# Altium project Relay Controller REV3.PrjPcb
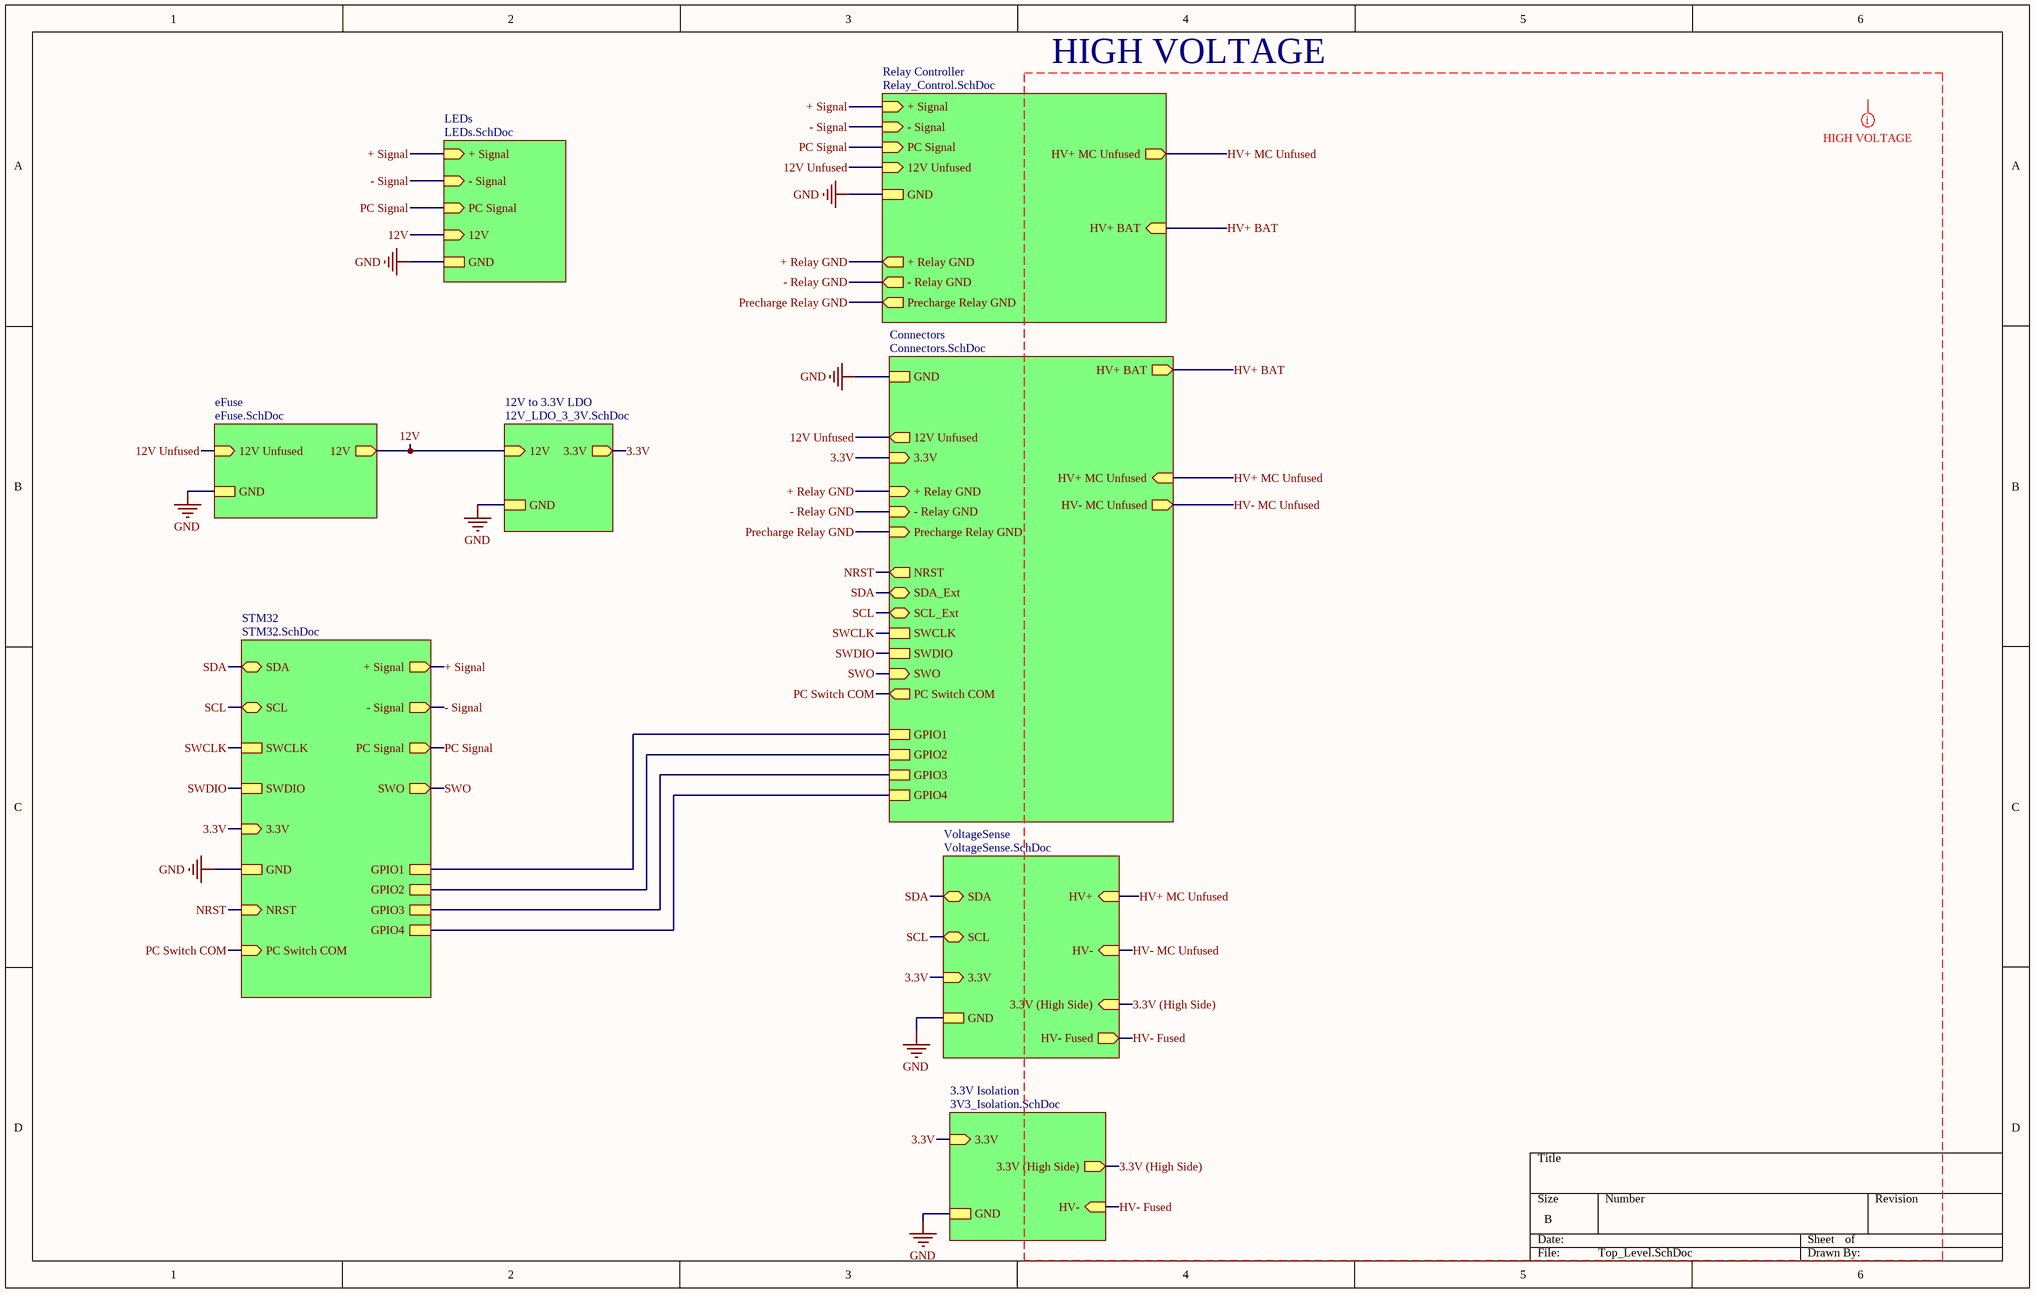
[diagram p0: Top_Level.SchDoc]
5 sheets, 30 parts. Net scope: hierarchical (ports join the sheet entries above them; power ports are global).
Board file: Relay_Controller_REV3.PcbDoc
Sheets:
  Top_Level.SchDoc
    Connectors = Connectors.SchDoc
    LEDs = LEDs.SchDoc
    VoltageSense = VoltageSense.SchDoc
    3.3V Isolation = 3V3_Isolation.SchDoc

## Sheet Top_Level.SchDoc
size B; SheetNumber: 5; SheetTotal: 5

### Sub-sheets
3.3V Isolation = 3V3_Isolation.SchDoc: GND, 3.3V (in), 3.3V (High Side) (out), HV- (in)
12V to 3.3V LDO = 12V_LDO_3_3V.SchDoc (file not in this document): 12V (in), GND, 3.3V (out)
Connectors = Connectors.SchDoc: GND, + Relay GND (in), - Relay GND (in), Precharge Relay GND (in), HV+ BAT (out), 12V Unfused (out), HV+ MC Unfused (in), HV- MC Unfused (out), 3.3V (in), SDA_Ext (bidir), SCL_Ext (bidir), SWCLK, SWDIO, SWO (in), NRST (out), GPIO1, GPIO2, GPIO3, GPIO4, PC Switch COM (out)
eFuse = eFuse.SchDoc (file not in this document): 12V Unfused (in), GND, 12V (out)
LEDs = LEDs.SchDoc: + Signal (in), - Signal (in), PC Signal (in), 12V (in), GND
Relay Controller = Relay_Control.SchDoc (file not in this document): + Signal (in), - Signal (in), PC Signal (in), 12V Unfused (in), GND, + Relay GND (out), - Relay GND (out), Precharge Relay GND (out), HV+ MC Unfused (out), HV+ BAT (in)
STM32 = STM32.SchDoc (file not in this document): SDA (bidir), SCL (bidir), 3.3V (in), + Signal (out), - Signal (out), PC Signal (out), GND, SWCLK, SWDIO, SWO (out), NRST (in), GPIO1, GPIO2, GPIO3, GPIO4, PC Switch COM (in)
VoltageSense = VoltageSense.SchDoc: HV+ (in), HV- (in), 3.3V (in), SDA (bidir), SCL (bidir), GND, 3.3V (High Side) (in), HV- Fused (out)

### Nets
GND: sheet Relay Controller/GND, sheet Connectors/GND, sheet LEDs/GND, sheet STM32/GND, sheet VoltageSense/GND, sheet eFuse/GND, sheet 12V to 3.3V LDO/GND, sheet 3.3V Isolation/GND
3.3V: sheet Connectors/3.3V, sheet STM32/3.3V, sheet VoltageSense/3.3V, sheet 12V to 3.3V LDO/3.3V, sheet 3.3V Isolation/3.3V
3.3V (High Side): sheet VoltageSense/3.3V (High Side), sheet 3.3V Isolation/3.3V (High Side)
12V: sheet LEDs/12V, sheet eFuse/12V, sheet 12V to 3.3V LDO/12V
12V Unfused: sheet Relay Controller/12V Unfused, sheet Connectors/12V Unfused, sheet eFuse/12V Unfused
+ Relay GND: sheet Relay Controller/+ Relay GND, sheet Connectors/+ Relay GND
+ Signal: sheet Relay Controller/+ Signal, sheet LEDs/+ Signal, sheet STM32/+ Signal
- Relay GND: sheet Relay Controller/- Relay GND, sheet Connectors/- Relay GND
- Signal: sheet Relay Controller/- Signal, sheet LEDs/- Signal, sheet STM32/- Signal
HV+ BAT: sheet Relay Controller/HV+ BAT, sheet Connectors/HV+ BAT
HV+ MC Unfused: sheet Relay Controller/HV+ MC Unfused, sheet Connectors/HV+ MC Unfused, sheet VoltageSense/HV+
HV- Fused: sheet VoltageSense/HV- Fused, sheet 3.3V Isolation/HV-  [project net HV-]
HV- MC Unfused: sheet Connectors/HV- MC Unfused, sheet VoltageSense/HV-
NRST: sheet Connectors/NRST, sheet STM32/NRST
PC Signal: sheet Relay Controller/PC Signal, sheet LEDs/PC Signal, sheet STM32/PC Signal
PC Switch COM: sheet Connectors/PC Switch COM, sheet STM32/PC Switch COM
Precharge Relay GND: sheet Relay Controller/Precharge Relay GND, sheet Connectors/Precharge Relay GND
SCL: sheet Connectors/SCL_Ext, sheet STM32/SCL, sheet VoltageSense/SCL
SDA: sheet Connectors/SDA_Ext, sheet STM32/SDA, sheet VoltageSense/SDA
SWCLK: sheet Connectors/SWCLK, sheet STM32/SWCLK
SWDIO: sheet Connectors/SWDIO, sheet STM32/SWDIO
SWO: sheet Connectors/SWO, sheet STM32/SWO
NetJ12_1: sheet Connectors/GPIO1, sheet STM32/GPIO1
NetJ12_2: sheet Connectors/GPIO2, sheet STM32/GPIO2
NetJ12_3: sheet Connectors/GPIO3, sheet STM32/GPIO3
NetJ12_4: sheet Connectors/GPIO4, sheet STM32/GPIO4

### Layout directives
mark named HIGH VOLTAGE: 3.3V (High Side), HV+ BAT, HV+ MC Unfused, HV- Fused, HV- MC Unfused

### Notes on the sheet
- HIGH VOLTAGE

## Sheet Connectors.SchDoc
size A; SheetNumber: 3; SheetTotal: 5
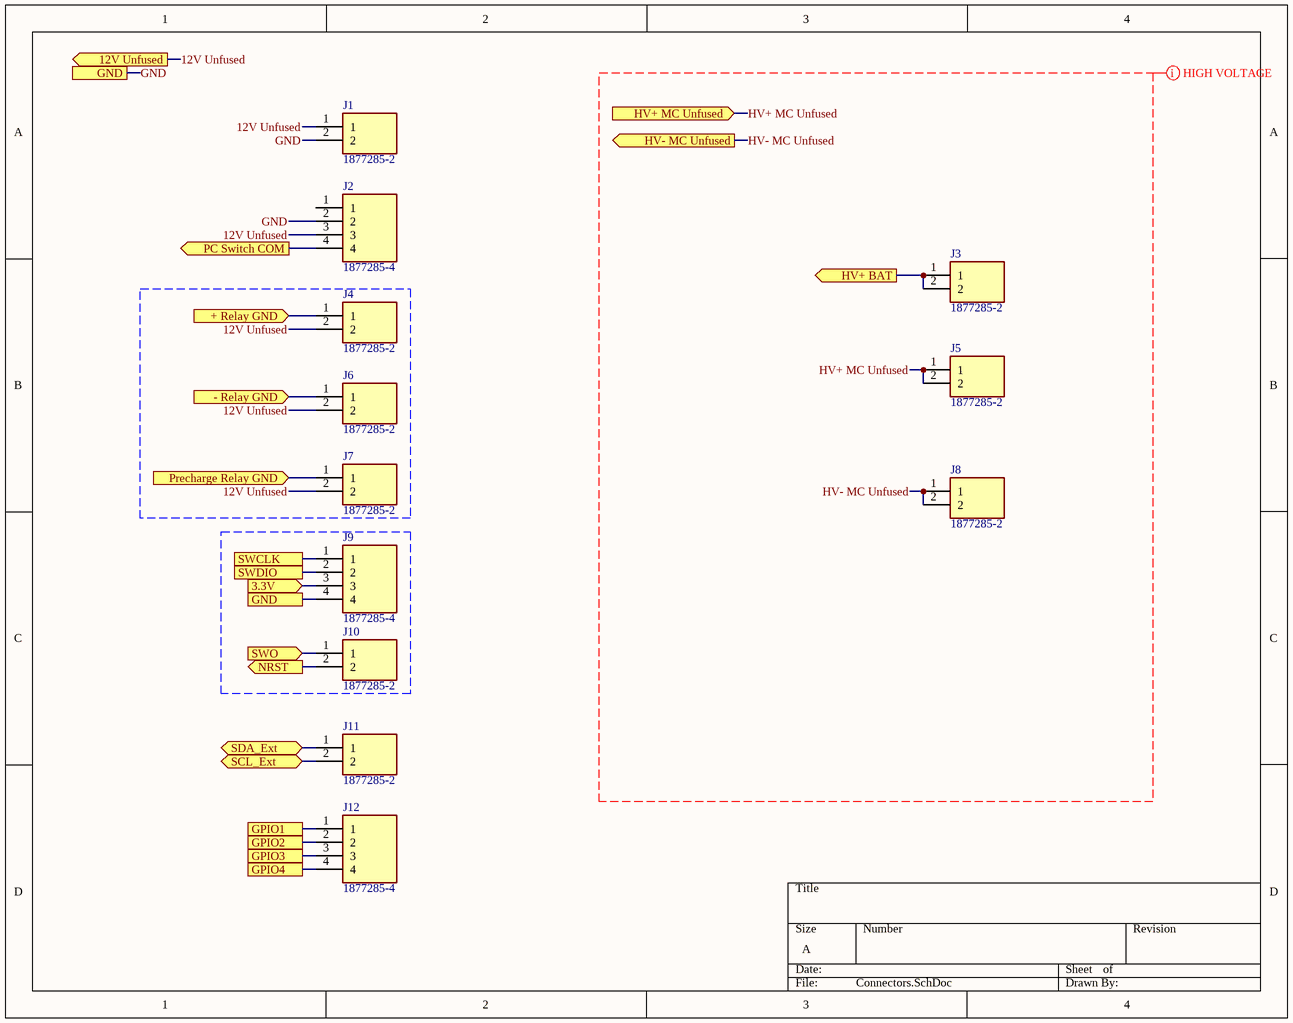
[diagram p1: Connectors.SchDoc]

### Parts
J1  1877285-2  [18772852]
J2  1877285-4  [18772854]
J3  1877285-2  [18772852]
J4  1877285-2  [18772852]
J5  1877285-2  [18772852]
J6  1877285-2  [18772852]
J7  1877285-2  [18772852]
J8  1877285-2  [18772852]
J9  1877285-4  [18772854]
J10  1877285-2  [18772852]
J11  1877285-2  [18772852]
J12  1877285-4  [18772854]

### Ports
3.3V (in), 12V Unfused (out), + Relay GND (in), - Relay GND (in), GND, GPIO1, GPIO2, GPIO3, GPIO4, HV+ BAT (out), HV+ MC Unfused (in), HV- MC Unfused (out), NRST (out), PC Switch COM (out), Precharge Relay GND (in), SCL_Ext (bidir), SDA_Ext (bidir), SWCLK, SWDIO, SWO (in)

### Nets
GND: J1.2 J2.2 J9.4 ; port GND
3.3V: J9.3 ; port 3.3V
12V Unfused: J1.1 J2.3 J4.2 J6.2 J7.2 ; port 12V Unfused
+ Relay GND: J4.1 ; port + Relay GND
- Relay GND: J6.1 ; port - Relay GND
HV+ BAT: J3.1 J3.2 ; port HV+ BAT
HV+ MC Unfused: J5.1 J5.2 ; port HV+ MC Unfused
HV- MC Unfused: J8.1 J8.2 ; port HV- MC Unfused
NRST: J10.2 ; port NRST
PC Switch COM: J2.4 ; port PC Switch COM
Precharge Relay GND: J7.1 ; port Precharge Relay GND
SCL: J11.2 ; port SCL_Ext
SDA: J11.1 ; port SDA_Ext
SWCLK: J9.1 ; port SWCLK
SWDIO: J9.2 ; port SWDIO
SWO: J10.1 ; port SWO
NetJ12_1: J12.1 ; port GPIO1
NetJ12_2: J12.2 ; port GPIO2
NetJ12_3: J12.3 ; port GPIO3
NetJ12_4: J12.4 ; port GPIO4

Not connected (* = marked no-connect by the designer): J2 1

### Layout directives
mark named HIGH VOLTAGE: HV+ MC Unfused, HV- MC Unfused

### Library data of the parts
J1 J3-J8 J10 J11 = 1877285-2: Connector; Manufacturer_Name: TE Connectivity; Datasheet Link: https://www.te.com/commerce/DocumentDelivery/DDEController?Action=srchrtrv&DocNm=7-1773458-5_ECONOMY_POWER_QRG&DocType=Data%20Sheet&DocLang=English&PartCntxt=1877285-2&DocFormat=pdf; Height: 12mm; Manufacturer_Part_Number: 1877285-2; Mouser Part Number: 571-1877285-2; Mouser Price/Stock: https://www.mouser.co.uk/ProductDetail/TE-Connectivity/1877285-2?qs=ka3zfMQDmFlAIZq5pDt5JA%3D%3D; Arrow Part Number: 1877285-2; Arrow Price/Stock: https://www.arrow.com/en/products/1877285-2/te-connectivity?region=europe
J2 J9 J12 = 1877285-4: Connector; Manufacturer_Name: TE Connectivity; Datasheet Link: https://www.te.com/commerce/DocumentDelivery/DDEController?Action=srchrtrv&DocNm=1877285&DocType=Customer%20Drawing&DocLang=English&PartCntxt=1877285-4&DocFormat=pdf; Height: 12.5mm; Manufacturer_Part_Number: 1877285-4; Mouser Part Number: 571-1877285-4; Mouser Price/Stock: https://www.mouser.co.uk/ProductDetail/TE-Connectivity/1877285-4?qs=ka3zfMQDmFkZPBtotDIXvQ%3D%3D; Arrow Part Number: 1877285-4; Arrow Price/Stock: https://www.arrow.com/en/products/1877285-4/te-connectivity?region=nac

## Sheet LEDs.SchDoc
size A; SheetNumber: 4; SheetTotal: 5
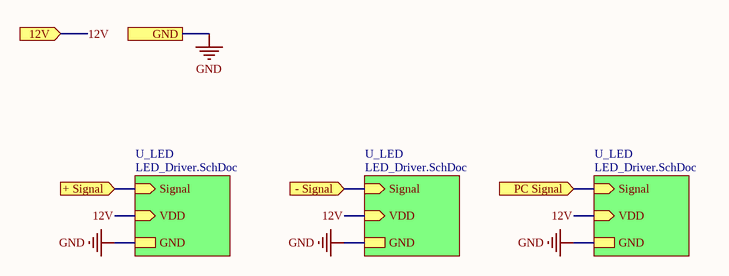
[diagram p2: LEDs.SchDoc]

### Sub-sheets
U_LED = LED_Driver.SchDoc (file not in this document): Signal (in), VDD (in), GND
U_LED = LED_Driver.SchDoc (file not in this document): Signal (in), VDD (in), GND
U_LED = LED_Driver.SchDoc (file not in this document): Signal (in), VDD (in), GND

### Ports
12V (in), + Signal (in), - Signal (in), GND, PC Signal (in)

### Nets
GND: port GND, sheet U_LED/GND, sheet U_LED/GND, sheet U_LED/GND
12V: port 12V, sheet U_LED/VDD, sheet U_LED/VDD, sheet U_LED/VDD
+ Signal: port + Signal, sheet U_LED/Signal
- Signal: port - Signal, sheet U_LED/Signal
PC Signal: port PC Signal, sheet U_LED/Signal

## Sheet VoltageSense.SchDoc
size A; SheetNumber: 5; SheetTotal: 5
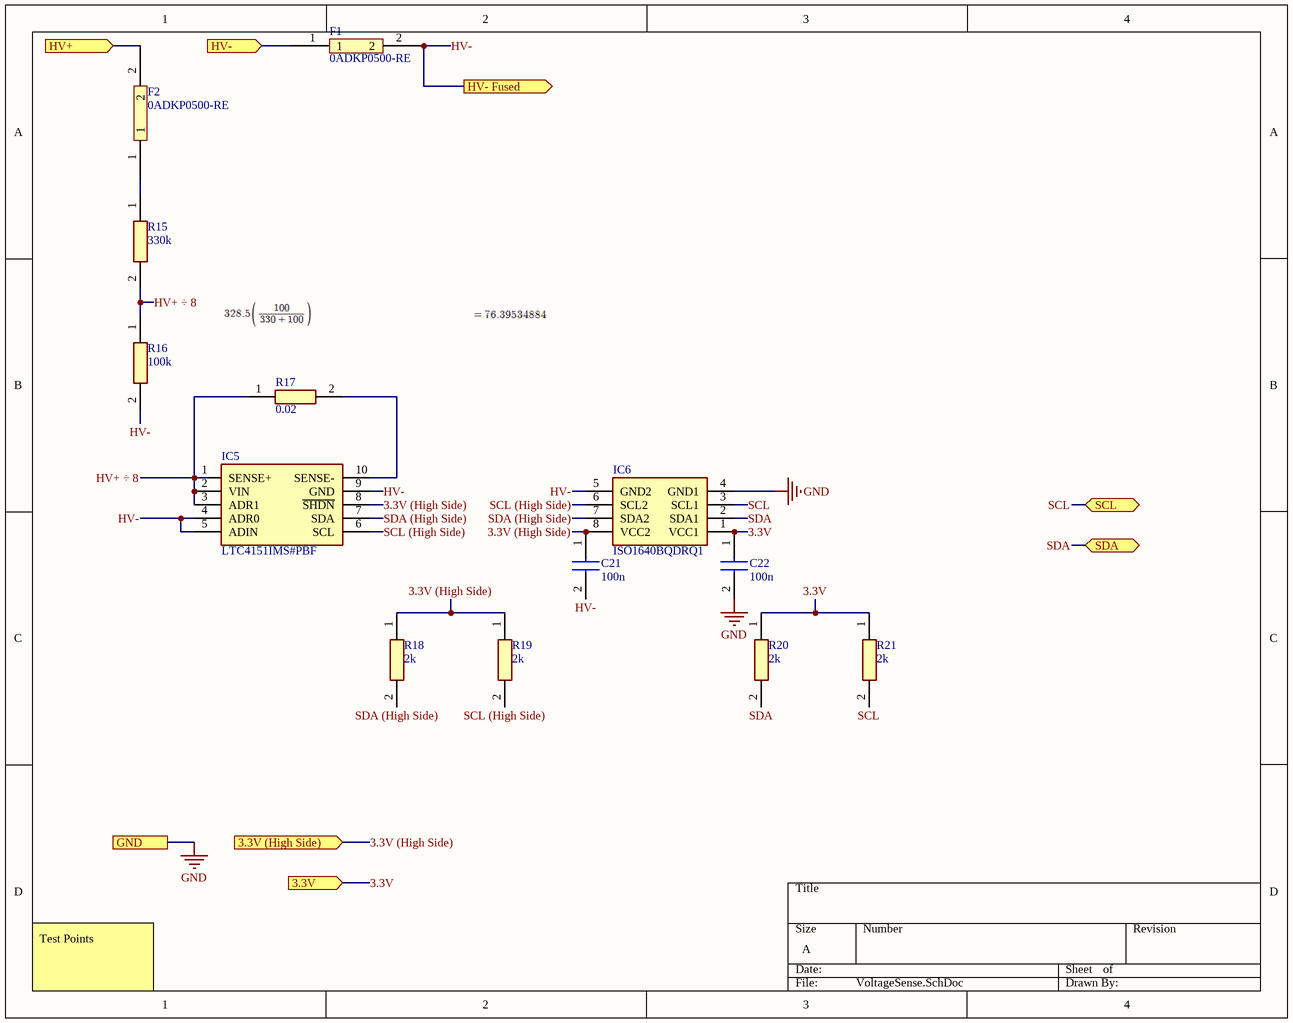
[diagram p3: VoltageSense.SchDoc]

### Parts
C21  100n  [CAPC3216X94N]
C22  100n  [CAPC3216X94N]
F1  0ADKP0500-RE  [0ADKP0500-RE]
F2  0ADKP0500-RE  [0ADKP0500-RE]
IC5  LTC4151IMS#PBF  [SOP50P490X110-10N]
IC6  ISO1640BQDRQ1  [SOIC127P600X175-8N]
R15  330k  [ERJP08_(1206)]
R16  100k  [RESC3216X65N]
R17  0.02  [RESC3216X68N]
R18  2k  [RESC3116X65N]
R19  2k  [RESC3116X65N]
R20  2k  [RESC3116X65N]
R21  2k  [RESC3116X65N]

### Ports
3.3V (High Side) (in), 3.3V (in), GND, HV+ (in), HV- (in), HV- Fused (out), SCL (bidir), SDA (bidir)

### Nets
GND: C22.2 IC6.4(GND1) ; port GND
3.3V: C22.1 IC6.1(VCC1) R20.1 R21.1 ; port 3.3V
3.3V (High Side): C21.1 IC5.8(~{SHDN}) IC6.8(VCC2) R18.1 R19.1 ; port 3.3V (High Side)
HV+ MC Unfused: F2.2 ; port HV+
HV+ ÷ 8: IC5.1(SENSE+) IC5.2(VIN) IC5.3(ADR1) R15.2 R16.1 R17.1
HV-: C21.2 F1.2 IC5.4(ADR0) IC5.5(ADIN) IC5.9(GND) IC6.5(GND2) R16.2 ; port HV- Fused
HV- MC Unfused: F1.1 ; port HV-
SCL: IC6.3(SCL1) R21.2 ; port SCL
SCL (High Side): IC5.6(SCL) IC6.6(SCL2) R19.2
SDA: IC6.2(SDA1) R20.2 ; port SDA
SDA (High Side): IC5.7(SDA) IC6.7(SDA2) R18.2
NetF2_1: F2.1 R15.1
NetIC5_10: IC5.10(SENSE-) R17.2

### Notes on the sheet
- Test Points

### Library data of the parts
C21 C22 = 12065C104J4Z2A: Capacitor; Manufacturer_Name: Kyocera AVX; Datasheet Link: https://spicat.kyocera-avx.com/product/mlcc/chartview/12065C104J4Z2A/DataSheet/X7R; Height: 0.94mm; Manufacturer_Part_Number: 12065C104J4Z2A; Mouser Part Number: 581-12065C104J4Z2A; Mouser Price/Stock: https://www.mouser.com/Search/Refine.aspx?Keyword=581-12065C104J4Z2A
F1 F2 = 0ADKP0500-RE: Fuse
IC5 = LTC4151IMS#PBF: Integrated Circuit; Manufacturer_Name: Analog Devices; Datasheet Link: http://www.linear.com/docs/26089; Height: 1.1mm; Manufacturer_Part_Number: LTC4151IMS#PBF; Mouser Part Number: 584-LTC4151IMS#PBF; Mouser Price/Stock: https://www.mouser.co.uk/ProductDetail/Analog-Devices/LTC4151IMSPBF?qs=hVkxg5c3xu%2F2n6Fpk%2FlWrA%3D%3D; Arrow Part Number: LTC4151IMS#PBF; Arrow Price/Stock: https://www.arrow.com/en/products/ltc4151imspbf/analog-devices?region=europe
IC6 = ISO1640BQDRQ1: Integrated Circuit; Manufacturer_Name: Texas Instruments; Datasheet Link: https://www.ti.com/lit/ds/symlink/iso1640.pdf; Height: 1.75mm; Manufacturer_Part_Number: ISO1640BQDRQ1; Mouser Part Number: 595-ISO1640BQDRQ1; Mouser Price/Stock: https://www.mouser.co.uk/ProductDetail/Texas-Instruments/ISO1640BQDRQ1?qs=QNEnbhJQKvat3Z1mRPODGw%3D%3D; Arrow Part Number: ISO1640BQDRQ1; Arrow Price/Stock: https://www.arrow.com/en/products/iso1640bqdrq1/texas-instruments?region=nac
R15 = ERJ-P08D3303V: Resistor; Manufacturer_Name: Panasonic; Datasheet Link: http://industrial.panasonic.com/cdbs/www-data/pdf/RDO0000/AOA0000C331.pdf; Height: 0.7mm; Manufacturer_Part_Number: ERJ-P08D3303V
R16 = MCA12060C1003FP500: Resistor; Manufacturer_Name: Vishay; Datasheet Link: https://componentsearchengine.com/Datasheets/1/MCA12060C1003FP500.pdf; Height: 0.65mm; Manufacturer_Part_Number: MCA12060C1003FP500; Mouser Part Number: 594-MCA12060C1003FP5; Mouser Price/Stock: https://www.mouser.com/Search/Refine.aspx?Keyword=594-MCA12060C1003FP5
R17 = PCS1206DR0200ET: Resistor; Manufacturer_Name: Ohmite; Datasheet Link: https://componentsearchengine.com/Datasheets/1/PCS1206DR0200ET.pdf; Height: 0.684mm; Manufacturer_Part_Number: PCS1206DR0200ET; Mouser Part Number: 588-PCS1206DR0200ET; Mouser Price/Stock: https://www.mouser.co.uk/ProductDetail/Ohmite/PCS1206DR0200ET?qs=Zz7%252BYVVL6bHe1REzh6xp%2Fw%3D%3D
R18-R21 = CHP1206AFX-2001ELF: Resistor; Manufacturer_Name: Bourns; Datasheet Link: https://www.mouser.mx/datasheet/2/54/chp-a-1858677.pdf; Height: 0.65mm; Manufacturer_Part_Number: CHP1206AFX-2001ELF; Mouser Part Number: 652-CHP1206AFX-2001L; Mouser Price/Stock: https://www.mouser.co.uk/ProductDetail/Bourns/CHP1206AFX-2001ELF?qs=GedFDFLaBXERFI3Dnxqg6Q%3D%3D

## Sheet 3V3_Isolation.SchDoc
size A
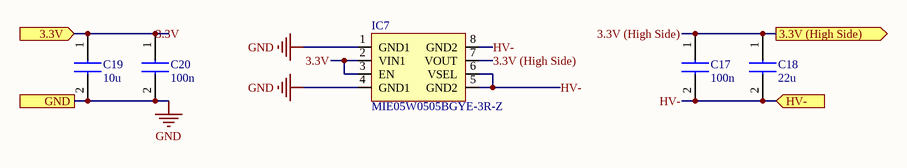
[diagram p4: 3V3_Isolation.SchDoc]

### Parts
C17  100n  [CAPC3216X94N]
C18  22u  [CAPC3216X180N]
C19  10u  [CAPC3216X180N]
C20  100n  [CAPC3216X94N]
IC7  MIE05W0505BGYE-3R-Z  [SOIC127P1030X265-8N]

### Ports
3.3V (High Side) (out), 3.3V (in), GND, HV- (in)

### Nets
GND: C19.2 C20.2 IC7.1(GND1) IC7.4(GND1) ; port GND
3.3V: C19.1 C20.1 IC7.2(VIN1) IC7.3(EN) ; port 3.3V
3.3V (High Side): C17.1 C18.1 IC7.7(VOUT) ; port 3.3V (High Side)
HV-: C17.2 C18.2 IC7.5(GND2) IC7.6(VSEL) IC7.8(GND2) ; port HV-

### Library data of the parts
C17 C20 = 12065C104J4Z2A: as C21 on sheet VoltageSense; Datasheet Link: https://spicat.kyocera-avx.com/product/mlcc/chartview/12065C104J4Z2A/DataSheet/X7R; Height: 0.94mm; Manufacturer_Part_Number: 12065C104J4Z2A; Mouser Part Number: 581-12065C104J4Z2A; Mouser Price/Stock: https://www.mouser.com/Search/Refine.aspx?Keyword=581-12065C104J4Z2A
C18 = GGM31CD70J226KE02L: Capacitor; Manufacturer_Name: Murata Electronics; Datasheet Link: https://search.murata.co.jp/Ceramy/image/img/A01X/G101/ENG/GGM31CD70J226KE02-01.pdf; Height: 1.8mm; Manufacturer_Part_Number: GGM31CD70J226KE02L
C19 = MLASU31LBB5106KTNA01: Capacitor; Manufacturer_Name: TAIYO YUDEN; Datasheet Link: https://mm.digikey.com/Volume0/opasdata/d220001/medias/docus/5731/MLR01_e.pdf; Height: 1.8mm; Manufacturer_Part_Number: MLASU31LBB5106KTNA01

## Nets that join several sheets
GND: Connectors (J1.2 J2.2 J9.4), VoltageSense (C22.2 IC6.4), 3V3_Isolation (C19.2 C20.2 IC7.1 IC7.4)
3.3V: Connectors (J9.3), VoltageSense (C22.1 IC6.1 R20.1 R21.1), 3V3_Isolation (C19.1 C20.1 IC7.2 IC7.3)
3.3V (High Side): VoltageSense (5 pins), 3V3_Isolation (C17.1 C18.1 IC7.7)
HV+ MC Unfused: Connectors (J5.1 J5.2), VoltageSense (F2.2)
HV-: VoltageSense (7 pins), 3V3_Isolation (5 pins)
HV- MC Unfused: Connectors (J8.1 J8.2), VoltageSense (F1.1)
SCL: Connectors (J11.2), VoltageSense (IC6.3 R21.2)
SDA: Connectors (J11.1), VoltageSense (IC6.2 R20.2)